# Altium project PCB_testMiltibard.PrjPCB
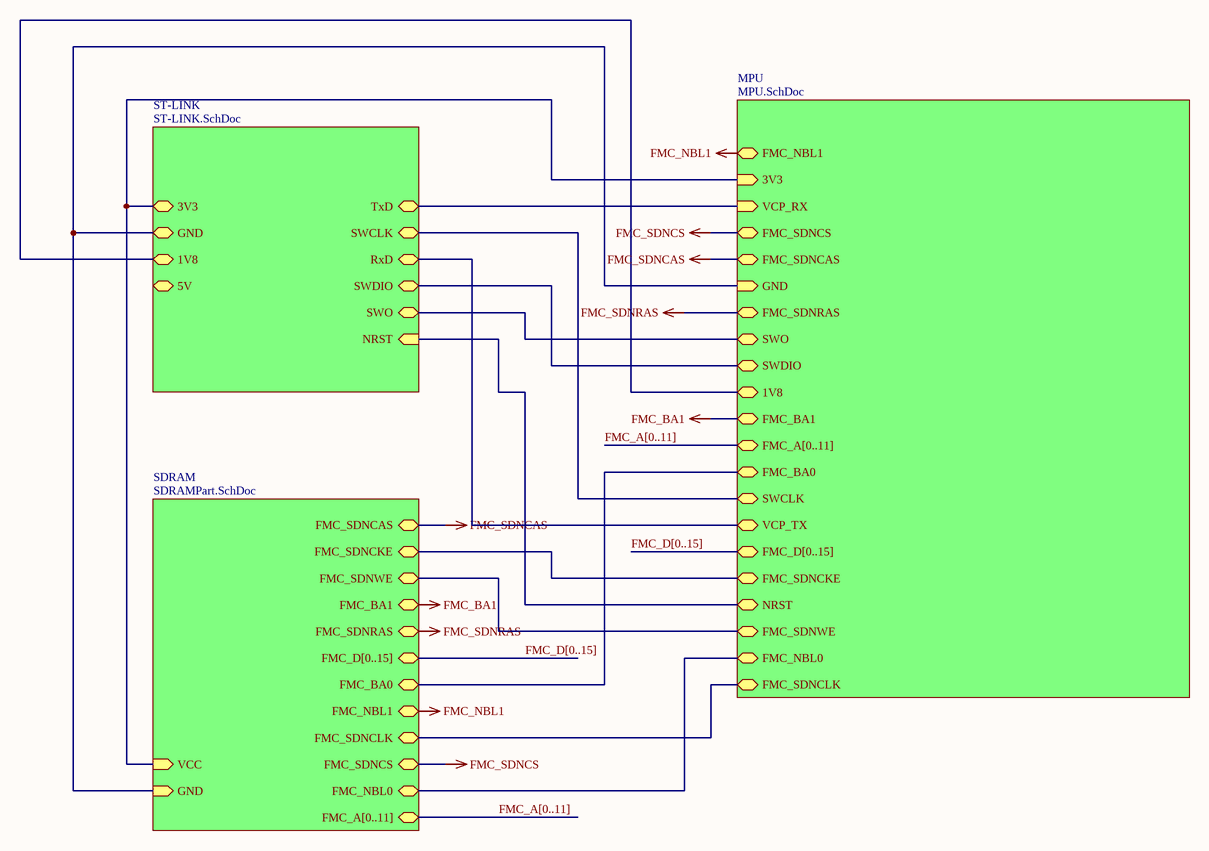
[diagram p0: Main.SchDoc]
4 sheets, 120 parts. Net scope: hierarchical (ports join the sheet entries above them; power ports are global).
Board file: PCB1.PcbDoc
Sheets:
  Main.SchDoc
    MPU = MPU.SchDoc
    ST-LINK = ST-LINK.SchDoc
    SDRAM = SDRAMPart.SchDoc

## Sheet Main.SchDoc
size 420 x 297 mm; Address1: Address1; Address2: Address2; Address3: Address3; Address4: Address4; SheetNumber: 1; Scale: 1:1; Разраб.: Иванов; Обозначение документа: АБВГ.123456.001 Э3; Пров.: Петров; Утв.: Сидоров; Наименование организации: ОАО "Концерн "МПО-Гидроприбор"; Перв. применение: АБВГ.123456.000; Наименование изделия 1: Плата; Наименование изделия 2: Схема электрическая; Наименование изделия 3: принципиальная; Нач. отд.: Нач. отд.; Фамилия нач. отд.: Сидоров

### Sub-sheets
MPU = MPU.SchDoc: FMC_NBL1 (bidir), 3V3 (in), VCP_RX (in), FMC_SDNCS (bidir), FMC_SDNCAS (bidir), GND (in), FMC_SDNRAS (bidir), SWO, SWDIO, 1V8, FMC_BA1 (bidir), FMC_A[0..11] (bidir), FMC_BA0 (bidir), SWCLK, VCP_TX, FMC_D[0..15] (bidir), FMC_SDNCKE (bidir), NRST, FMC_SDNWE (bidir), FMC_NBL0 (bidir), FMC_SDNCLK (bidir)
SDRAM = SDRAMPart.SchDoc: FMC_SDNCAS (bidir), FMC_SDNCKE (bidir), FMC_SDNWE (bidir), FMC_BA1 (bidir), FMC_SDNRAS (bidir), FMC_D[0..15] (bidir), FMC_BA0 (bidir), FMC_NBL1 (bidir), FMC_SDNCLK (bidir), FMC_SDNCS (bidir), FMC_NBL0 (bidir), FMC_A[0..11] (bidir), VCC (in), GND (in)
ST-LINK = ST-LINK.SchDoc: TxD (bidir), SWCLK (bidir), RxD (bidir), SWDIO (bidir), SWO (bidir), NRST (in), 3V3 (bidir), GND (bidir), 1V8 (bidir), 5V (bidir)

### Nets
1V8: sheet MPU/1V8, sheet ST-LINK/1V8
3V3: sheet MPU/3V3, sheet ST-LINK/3V3, sheet SDRAM/VCC
FMC_BA1: sheet MPU/FMC_BA1, sheet SDRAM/FMC_BA1
FMC_NBL1: sheet MPU/FMC_NBL1, sheet SDRAM/FMC_NBL1
FMC_SDNCAS: sheet MPU/FMC_SDNCAS, sheet SDRAM/FMC_SDNCAS
FMC_SDNCS: sheet MPU/FMC_SDNCS, sheet SDRAM/FMC_SDNCS
FMC_SDNRAS: sheet MPU/FMC_SDNRAS, sheet SDRAM/FMC_SDNRAS
GND: sheet MPU/GND, sheet ST-LINK/GND, sheet SDRAM/GND
NRST: sheet MPU/NRST, sheet ST-LINK/NRST
SWCLK: sheet MPU/SWCLK, sheet ST-LINK/SWCLK
SWDIO: sheet MPU/SWDIO, sheet ST-LINK/SWDIO
SWO: sheet MPU/SWO, sheet ST-LINK/SWO
VCP_RX: sheet MPU/VCP_RX, sheet ST-LINK/TxD
VCP_TX: sheet MPU/VCP_TX, sheet ST-LINK/RxD
FMC_BA0: sheet MPU/FMC_BA0, sheet SDRAM/FMC_BA0
FMC_NBL0: sheet MPU/FMC_NBL0, sheet SDRAM/FMC_NBL0
FMC_SDNCKE: sheet MPU/FMC_SDNCKE, sheet SDRAM/FMC_SDNCKE
FMC_SDNCLK: sheet MPU/FMC_SDNCLK, sheet SDRAM/FMC_SDNCLK
FMC_SDNWE: sheet MPU/FMC_SDNWE, sheet SDRAM/FMC_SDNWE

### Buses and harness runs
bus FMC_A[0..11] = sheet MPU/FMC_A[0..11]
bus FMC_A[0..11] = sheet SDRAM/FMC_A[0..11]
bus FMC_D[0..15] = sheet MPU/FMC_D[0..15]
bus FMC_D[0..15] = sheet SDRAM/FMC_D[0..15]

### Notes on the sheet
- Перв. примен.
- Справ. №
- Подп. и дата
- Инв. № дубл.
- Взам. инв. №
- Разраб.
- Изм.
- Лист
- № докум.
- Подп.
- Дата
- Лит.
- Масса
- Масштаб
- Пров.
- Т.контр.
- Листов
- Инв. № подл.
- Утв.
- Н.контр.
- Копировал
- Формат А3

## Sheet MPU.SchDoc
size 420 x 297 mm; Address1: Address1; Address2: Address2; Address3: Address3; Address4: Address4; SheetNumber: 1; Scale: 1:1; Разраб.: Иванов; Обозначение документа: АБВГ.123456.001 Э3; Пров.: Петров; Утв.: Сидоров; Наименование организации: ОАО "Концерн "МПО-Гидроприбор"; Перв. применение: АБВГ.123456.000; Наименование изделия 1: Плата; Наименование изделия 2: Схема электрическая; Наименование изделия 3: принципиальная; Нач. отд.: Нач. отд.; Фамилия нач. отд.: Сидоров
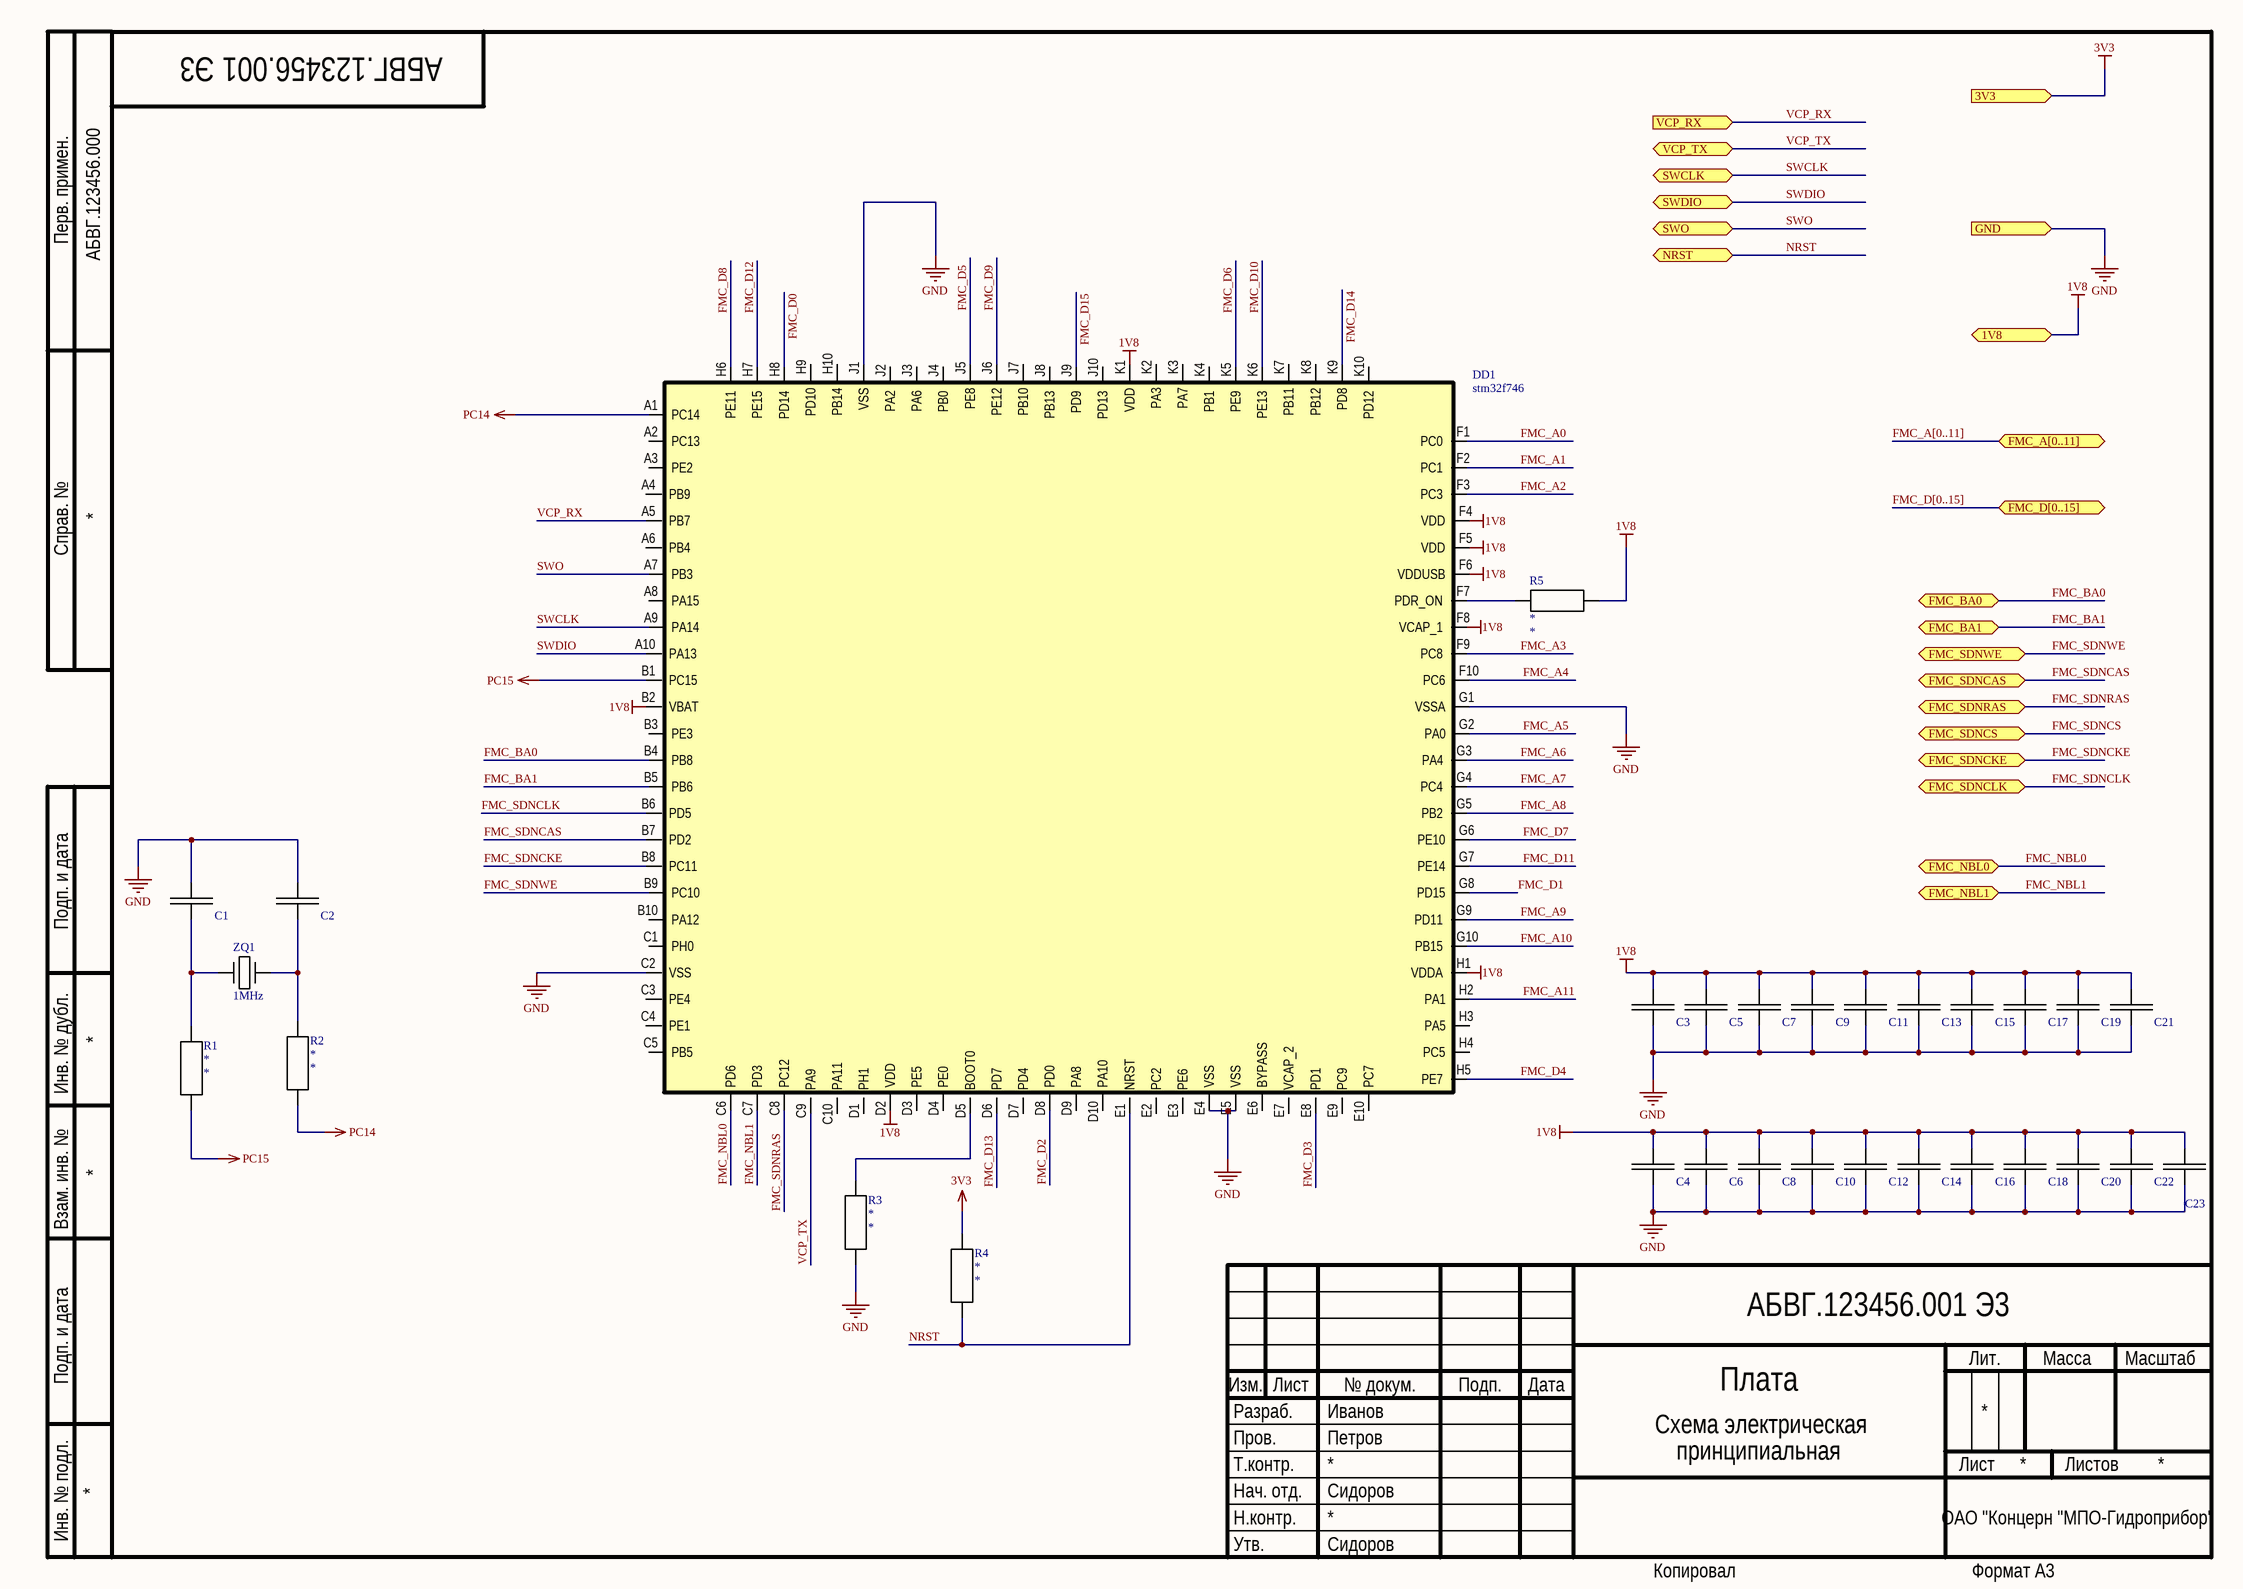
[diagram p1: MPU.SchDoc]

### Parts
C1  *  [CAP0402]  (value not drawn)
C2  *  [CAP0402]  (value not drawn)
C3  *  [CAP0402]  (value not drawn)
C4  *  [CAP0402]  (value not drawn)
C5  *  [CAP0402]  (value not drawn)
C6  *  [CAP0402]  (value not drawn)
C7  *  [CAP0402]  (value not drawn)
C8  *  [CAP0402]  (value not drawn)
C9  *  [CAP0402]  (value not drawn)
C10  *  [CAP0402]  (value not drawn)
C11  *  [CAP0402]  (value not drawn)
C12  *  [CAP0402]  (value not drawn)
C13  *  [CAP0402]  (value not drawn)
C14  *  [CAP0402]  (value not drawn)
C15  *  [CAP0402]  (value not drawn)
C16  *  [CAP0402]  (value not drawn)
C17  *  [CAP0402]  (value not drawn)
C18  *  [CAP0402]  (value not drawn)
C19  *  [CAP0402]  (value not drawn)
C20  *  [CAP0402]  (value not drawn)
C21  *  [CAP0402]  (value not drawn)
C22  *  [CAP0402]  (value not drawn)
C23  *  [CAP0402]  (value not drawn)
DD1  stm32f746  [BGA100P9X9-81A]
R1  *  [0402]
R2  *  [0402]
R3  *  [0402]
R4  *  [0402]
R5  *  [0402]
ZQ1  1MHz  [KX-7]

### Ports
1V8, 3V3 (in), FMC_A[0..11] (bidir), FMC_BA0 (bidir), FMC_BA1 (bidir), FMC_D[0..15] (bidir), FMC_NBL0 (bidir), FMC_NBL1 (bidir), FMC_SDNCAS (bidir), FMC_SDNCKE (bidir), FMC_SDNCLK (bidir), FMC_SDNCS (bidir), FMC_SDNRAS (bidir), FMC_SDNWE (bidir), GND (in), NRST, SWCLK, SWDIO, SWO, VCP_RX (in), VCP_TX

### Nets
1V8: C3.1 C4.1 C5.1 C6.1 C7.1 C8.1 C9.1 C10.1 C11.1 C12.1 C13.1 C14.1 C15.1 C16.1 C17.1 C18.1 C19.1 C20.1 C21.1 C22.1 C23.1 DD1.B2(VBAT) DD1.D2(VDD) DD1.F4(VDD) DD1.F5(VDD) DD1.F6(VDDUSB) DD1.F8(VCAP_1) DD1.H1(VDDA) DD1.K1(VDD) R5.1 ; port 1V8
3V3: R4.2 ; port 3V3
FMC_BA1: DD1.B5(PB6) ; port FMC_BA1
FMC_NBL1: DD1.C7(PD3) ; port FMC_NBL1
FMC_SDNCAS: DD1.B7(PD2) ; port FMC_SDNCAS
FMC_SDNRAS: DD1.C8(PC12) ; port FMC_SDNRAS
GND: C1.1 C2.1 C3.2 C4.2 C5.2 C6.2 C7.2 C8.2 C9.2 C10.2 C11.2 C12.2 C13.2 C14.2 C15.2 C16.2 C17.2 C18.2 C19.2 C20.2 C21.2 C22.2 C23.2 DD1.C2(VSS) DD1.E4(VSS) DD1.E5(VSS) DD1.G1(VSSA) DD1.J1(VSS) R3.1 ; port GND
NRST: DD1.E1(NRST) R4.1 ; port NRST
PC14: DD1.A1(PC14) R2.1
PC15: DD1.B1(PC15) R1.1
SWCLK: DD1.A9(PA14) ; port SWCLK
SWDIO: DD1.A10(PA13) ; port SWDIO
SWO: DD1.A7(PB3) ; port SWO
VCP_RX: DD1.A5(PB7) ; port VCP_RX
VCP_TX: DD1.C9(PA9) ; port VCP_TX
FMC_A0: DD1.F1(PC0)
FMC_A1: DD1.F2(PC1)
FMC_A2: DD1.F3(PC3)
FMC_A3: DD1.F9(PC8)
FMC_A4: DD1.F10(PC6)
FMC_A5: DD1.G2(PA0)
FMC_A6: DD1.G3(PA4)
FMC_A7: DD1.G4(PC4)
FMC_A8: DD1.G5(PB2)
FMC_A9: DD1.G9(PD11)
FMC_A10: DD1.G10(PB15)
FMC_A11: DD1.H2(PA1)
FMC_BA0: DD1.B4(PB8) ; port FMC_BA0
FMC_D0: DD1.H8(PD14)
FMC_D1: DD1.G8(PD15)
FMC_D2: DD1.D8(PD0)
FMC_D3: DD1.E8(PD1)
FMC_D4: DD1.H5(PE7)
FMC_D5: DD1.J5(PE8)
FMC_D6: DD1.K5(PE9)
FMC_D7: DD1.G6(PE10)
FMC_D8: DD1.H6(PE11)
FMC_D9: DD1.J6(PE12)
FMC_D10: DD1.K6(PE13)
FMC_D11: DD1.G7(PE14)
FMC_D12: DD1.H7(PE15)
FMC_D13: DD1.D6(PD7)
FMC_D14: DD1.K9(PD8)
FMC_D15: DD1.J9(PD9)
FMC_NBL0: DD1.C6(PD6) ; port FMC_NBL0
FMC_SDNCKE: DD1.B8(PC11) ; port FMC_SDNCKE
FMC_SDNCLK: DD1.B6(PD5) ; port FMC_SDNCLK
FMC_SDNWE: DD1.B9(PC10) ; port FMC_SDNWE
NetC1_2: C1.2 R1.2 ZQ1.1
NetC2_2: C2.2 R2.2 ZQ1.3
NetDD1_D5: DD1.D5(BOOT0) R3.2
NetDD1_F7: DD1.F7(PDR_ON) R5.2

Not connected (* = marked no-connect by the designer): DD1 A2(PC13) A3(PE2) A4(PB9) A6(PB4) A8(PA15) B3(PE3) B10(PA12) C1(PH0) C3(PE4) C4(PE1) C5(PB5) C10(PA11) D1(PH1) D3(PE5) D4(PE0) D7(PD4) D9(PA8) D10(PA10) E2(PC2) E3(PE6) E6(BYPASS) E7(VCAP_2) E9(PC9) E10(PC7) H3(PA5) H4(PC5) H9(PD10) H10(PB14) J2(PA2) J3(PA6) J4(PB0) J7(PB10) J8(PB13) J10(PD13) K2(PA3) K3(PA7) K4(PB1) K7(PB11) K8(PB12) K10(PD12)

### Buses and harness runs
bus FMC_A[0..11] = port FMC_A[0..11]
bus FMC_D[0..15] = port FMC_D[0..15]

### Notes on the sheet
- Перв. примен.
- Справ. №
- Подп. и дата
- Инв. № дубл.
- Взам. инв. №
- Разраб.
- Изм.
- Лист
- № докум.
- Подп.
- Дата
- Лит.
- Масса
- Масштаб
- Пров.
- Т.контр.
- Листов
- Инв. № подл.
- Утв.
- Н.контр.
- Копировал
- Формат А3

### Library data of the parts
C1-C23 = Capasitor: Value: *; Voltage: *; Part Number: *; Quantity: *; Package: *; Price: *; Manufacturer: *; ShoppingPlace: *
DD1 = stm32f746: Manufacturer: STM; Part Number: stm32f746; Package: LQFP48; Quantity: 1
R1-R5 = Resistor: Manufacturer: *; Quntity: *; Price: *; Part Number: *; Package: *; Value: *; Power: *
ZQ1 = Rzanator: Part Number: HC-51; Manufacturer: CHina; Value: 1MHz; Package: HC-51; Quantity: 1; Price: 13; ShoppingPlace: https://ru.aliexpress.com/item/1-MHz-Quartz-Crystal-Resonator-HC-51-U-1-000-MHz-1000-KHz/32542776281.html?ws_ab_test=searchweb0_0,searchweb201602_2_10152_10151_10065_10344_10068_10342_10343_10340_10341_10697_10696_10084_5722520_10083_10618_10307_10059_5722620_5722920_10534_308_5722720_5722820_100031_10103_441_10624_10623_10622_10621_10620,searchweb201603_68,ppcSwitch_5&algo_expid=89d4295e-121a-47e9-b7f5-26405723b7a9-0&algo_pvid=89d4295e-121a-47e9-b7f5-26405723b7a9&transAbTest=ae803_2&priceBeautifyAB=0

## Sheet ST-LINK.SchDoc
size 594 x 420 mm; Address1: Address1; Address2: Address2; Address3: Address3; Address4: Address4; SheetNumber: 1; Scale: 1:1; Разраб.: Иванов; Обозначение документа: АБВГ.123456.001 Э3; Пров.: Петров; Утв.: Сидоров; Наименование организации: ОАО "Концерн "МПО-Гидроприбор"; Перв. применение: АБВГ.123456.000; Наименование изделия 1: Плата; Наименование изделия 2: Схема электрическая; Наименование изделия 3: принципиальная; Нач. отд.: Нач. отд.; Фамилия нач. отд.: Сидоров
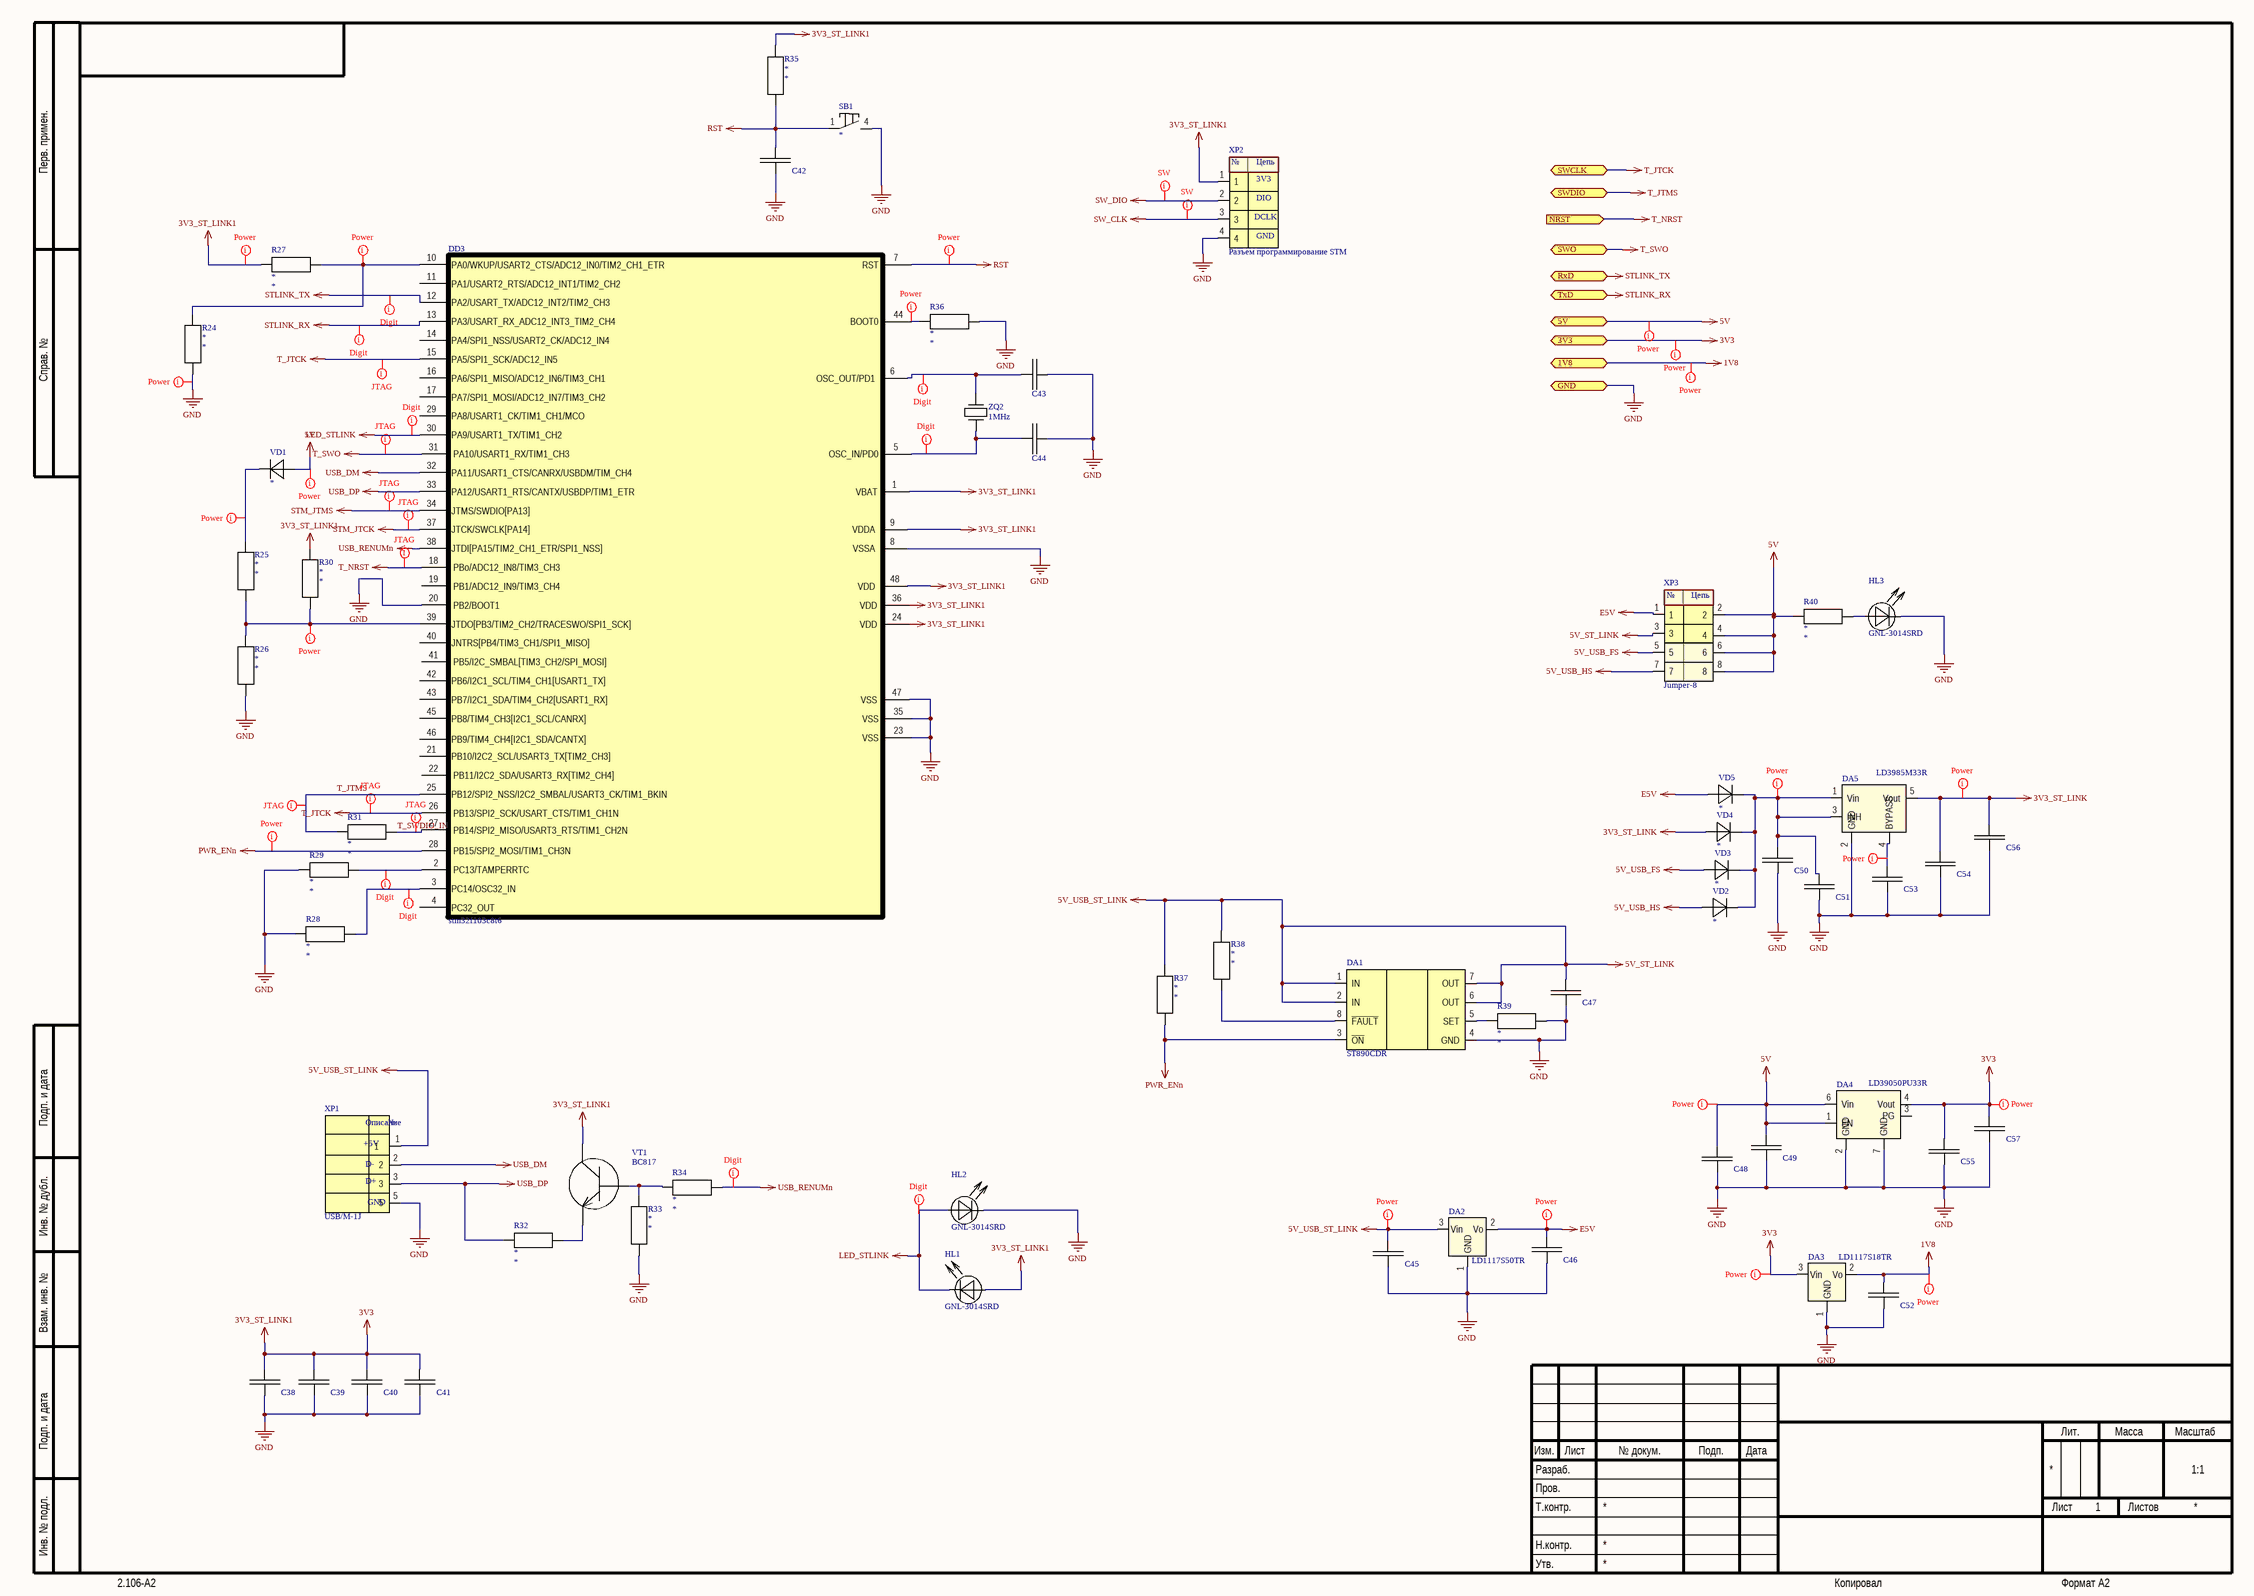
[diagram p2: ST-LINK.SchDoc]

### Parts
C38  *  [CAP0402]  (value not drawn)
C39  *  [CAP0402]  (value not drawn)
C40  *  [CAP0402]  (value not drawn)
C41  *  [CAP0402]  (value not drawn)
C42  *  [CAP0402]  (value not drawn)
C43  *  [CAP0402]  (value not drawn)
C44  *  [CAP0402]  (value not drawn)
C45  *  [CAP0402]  (value not drawn)
C46  *  [CAP0402]  (value not drawn)
C47  *  [CAP0402]  (value not drawn)
C48  *  [CAP0402]  (value not drawn)
C49  *  [CAP0402]  (value not drawn)
C50  *  [CAP0402]  (value not drawn)
C51  *  [CAP0402]  (value not drawn)
C52  *  [CAP0402]  (value not drawn)
C53  *  [CAP0402]  (value not drawn)
C54  *  [CAP0402]  (value not drawn)
C55  *  [CAP0402]  (value not drawn)
C56  *  [CAP0402]  (value not drawn)
C57  *  [CAP0402]  (value not drawn)
DA1  ST890CDR  [SO-8]
DA2  LD1117S50TR  [SOD-223]
DA3  LD1117S18TR  [SOD-223]
DA4  LD39050PU33R  [DFN-6(3x3)]
DA5  LD3985M33R  [SOT23-5]
DD3  stm32f103c8t6  [LQFP48]
HL1  GNL-3014SRD  [LED1206]
HL2  GNL-3014SRD  [LED1206]
HL3  GNL-3014SRD  [LED1206]
R24  *  [0402]
R25  *  [0402]
R26  *  [0402]
R27  *  [0402]
R28  *  [0402]
R29  *  [0402]
R30  *  [0402]
R31  *  [0402]
R32  *  [0402]
R33  *  [0402]
R34  *  [0402]
R35  *  [0402]
R36  *  [0402]
R37  *  [0402]
R38  *  [0402]
R39  *  [0402]
R40  *  [0402]
SB1  *  [KLS2]
VD1  *  [melf]
VD2  *  [MINIMELF]
VD3  *  [MINIMELF]
VD4  *  [MINIMELF]
VD5  *  [MINIMELF]
VT1  BC817  [SOT23-3]
XP1  USB/M-1J  [USB/M-1J]
XP2  Разъем программирование STM  [Connector_STKLink]
XP3  Jumper-8  [PLS-4-2]
ZQ2  1MHz  [HC-51U]

### Ports
1V8 (bidir), 3V3 (bidir), 5V (bidir), GND (bidir), NRST (in), RxD (bidir), SWCLK (bidir), SWDIO (bidir), SWO (bidir), TxD (bidir)

### Nets
1V8: C52.1 DA3.2(Vo) ; port 1V8
3V3: C38.1 C39.1 C40.1 C41.1 C55.1 C57.1 DA3.3(Vin) DA4.4(Vout) DD3.1(VBAT) DD3.9(VDDA) DD3.24(VDD) DD3.36(VDD) DD3.48(VDD) HL1.1 R27.1 R30.2 R35.2 VT1.3 XP2.1 ; port 3V3  [also labelled 3V3_ST_LINK1]
3V3_ST_LINK: C54.1 C56.1 DA5.5(Vout) VD4.1
5V: C48.1 C49.1 DA4.1(EN) DA4.6(Vin) R40.2 VD1.1 XP3.2 XP3.4 XP3.6 XP3.8 ; port 5V
5V_ST_LINK: C45.1 C47.1 DA1.1(IN) DA1.2(IN) DA1.6(OUT) DA1.7(OUT) DA2.3(Vin) R37.2 R38.2 XP1.1 XP3.3  [also labelled 5V_USB_ST_LINK]
5V_USB_FS: VD3.1 XP3.5
5V_USB_HS: VD2.1 XP3.7
E5V: C46.1 DA2.2(Vo) VD5.1 XP3.1
GND: C38.2 C39.2 C40.2 C41.2 C42.2 C43.2 C44.2 C45.2 C46.2 C47.2 C48.2 C49.2 C50.2 C51.2 C52.2 C53.2 C54.2 C55.2 C56.2 C57.2 DA1.4(GND) DA2.1(GND) DA3.1(GND) DA4.2(GND) DA4.7(GND) DA5.2(GND) DD3.8(VSSA) DD3.20(PB2/BOOT1) DD3.23(VSS) DD3.35(VSS) DD3.47(VSS) HL2.2 HL3.2 R24.1 R26.1 R28.1 R29.1 R33.1 R36.1 R39.1 SB1.4 XP1.5 XP2.4 ; port GND
LED_STLINK: DD3.30(PA9/USART1_TX/TIM1_CH2) HL1.2 HL2.1
PWR_ENn: DA1.3(~{ON}) DD3.28(PB15/SPI2_MOSI/TIM1_CH3N) R37.1
RST: C42.1 DD3.7(RST) R35.1 SB1.1
STLINK_RX: DD3.13(PA3/USART_RX_ADC12_INT3_TIM2_CH4) ; port TxD  [project net VCP_RX]
STLINK_TX: DD3.12(PA2/USART_TX/ADC12_INT2/TIM2_CH3) ; port RxD  [project net VCP_TX]
STM_JTCK: DD3.37(JTCK/SWCLK[PA14])
STM_JTMS: DD3.34(JTMS/SWDIO[PA13])
SW_CLK: XP2.3
SW_DIO: XP2.2
T_JTCK: DD3.15(PA5/SPI1_SCK/ADC12_IN5) DD3.26(PB13/SPI2_SCK/USART_CTS/TIM1_CH1N) ; port SWCLK  [project net SWCLK]
T_JTMS: DD3.25(PB12/SPI2_NSS/I2C2_SMBAL/USART3_CK/TIM1_BKIN) R31.1 ; port SWDIO  [project net SWDIO]
T_NRST: DD3.18(PBo/ADC12_IN8/TIM3_CH3) ; port NRST  [project net NRST]
T_SWO: DD3.31(PA10/USART1_RX/TIM1_CH3) ; port SWO  [project net SWO]
USB_DM: DD3.32(PA11/USART1_CTS/CANRX/USBDM/TIM_CH4) XP1.2
USB_DP: DD3.33(PA12/USART1_RTS/CANTX/USBDP/TIM1_ETR) R32.1 XP1.3
USB_RENUMn: DD3.38(JTDI[PA15/TIM2_CH1_ETR/SPI1_NSS]) R34.2
T_SWDIO_IN: DD3.27(PB14/SPI2_MISO/USART3_RTS/TIM1_CH2N) R31.2
NetC43_1: C43.1 DD3.6(OSC_OUT/PD1) ZQ2.3
NetC44_1: C44.1 DD3.5(OSC_IN/PD0) ZQ2.1
NetC50_1: C50.1 C51.1 DA5.1(Vin) DA5.3(INH) VD2.2 VD3.2 VD4.2 VD5.2
NetC53_1: C53.1 DA5.4(BYPASS)
NetDA1_5: DA1.5(SET) R39.2
NetDA1_8: DA1.8(~{FAULT}) R38.1
NetDD3_2: DD3.2(PC13/TAMPERRTC) R29.2
NetDD3_3: DD3.3(PC14/OSC32_IN) R28.2
NetDD3_10: DD3.10(PA0/WKUP/USART2_CTS/ADC12_IN0/TIM2_CH1_ETR) R24.2 R27.2
NetDD3_39: DD3.39(JTDO[PB3/TIM2_CH2/TRACESWO/SPI1_SCK]) R25.1 R26.2 R30.1
NetDD3_44: DD3.44(BOOT0) R36.2
NetHL3_1: HL3.1 R40.1
NetR25_2: R25.2 VD1.2
NetR32_2: R32.2 VT1.2
NetR33_2: R33.2 R34.1 VT1.1

Not connected (* = marked no-connect by the designer): DA4 3(PG); DD3 4(PC32_OUT) 11(PA1/USART2_RTS/ADC12_INT1/TIM2_CH2) 14(PA4/SPI1_NSS/USART2_CK/ADC12_IN4) 16(PA6/SPI1_MISO/ADC12_IN6/TIM3_CH1) 17(PA7/SPI1_MOSI/ADC12_IN7/TIM3_CH2) 19(PB1/ADC12_IN9/TIM3_CH4) 21(PB10/I2C2_SCL/USART3_TX[TIM2_CH3]) 22(PB11/I2C2_SDA/USART3_RX[TIM2_CH4]) 29(PA8/USART1_CK/TIM1_CH1/MCO) 40(JNTRS[PB4/TIM3_CH1/SPI1_MISO]) 41(PB5/I2C_SMBAL[TIM3_CH2/SPI_MOSI]) 42(PB6/I2C1_SCL/TIM4_CH1[USART1_TX]) 43(PB7/I2C1_SDA/TIM4_CH2[USART1_RX]) 45(PB8/TIM4_CH3[I2C1_SCL/CANRX]) 46(PB9/TIM4_CH4[I2C1_SDA/CANTX])

### Layout directives
net class Power: 1V8, 3V3, 3V3_ST_LINK, 5V, 5V_ST_LINK, E5V, GND, NetC50_1, NetC53_1, NetDD3_10, NetDD3_39, NetDD3_44, NetR25_2, PWR_ENn, RST
net class DIGIT: LED_STLINK, NetC43_1, NetC44_1, NetDD3_2, NetDD3_3, USB_RENUMn, VCP_RX, VCP_TX
net class JTAG: NRST, STM_JTCK, STM_JTMS, SWCLK, SWDIO, SWO, T_SWDIO_IN
net class SerialWire: SW_CLK, SW_DIO

### Notes on the sheet
- Перв. примен.
- Справ. №
- Подп. и дата
- Инв. № дубл.
- Взам. инв. №
- Разраб.
- Изм.
- Лист
- № докум.
- Подп.
- Дата
- Лит.
- Масса
- Масштаб
- Пров.
- Т.контр.
- Листов
- Инв. № подл.
- Утв.
- Н.контр.
- 2.106-A2
- Копировал
- Формат А2
- (in symbol Connector_STKLink) №; Цепь; 3V3; DIO; DCLK; GND
- (in symbol Jumper-8) №; Цепь
- (in symbol USB-M-1J) Описание; №; +5V; D-; D+; GND

### Library data of the parts
C38-C57 = Capasitor: Value: *; Voltage: *; Part Number: *; Quantity: *; Package: *; Price: *; Manufacturer: *; ShoppingPlace: *
DA1 = ST890CDR: Manufacturer: Texas Instruments; Value: 3V; Part Number: ST890CDR; Quantity: 1; Package: SOT-23-6; Price: 1.58; ShoppingPlace: https://www.digikey.com/product-detail/en/texas-instruments/TPS78230DDCR/296-24372-2-ND/2051745
DA2 = LD1117S50TR: Manufacturer: Texas Instruments; Value: 3V; Part Number: LD1117S50TR; Quantity: 1; Package: SOT-23-6; Price: 1.58
DA3 = LD1117S18TR: Manufacturer: Texas Instruments; Value: 3V; Part Number: LD1117S18TR; Quantity: 1; Package: SOT-23-6; Price: 1.58
DA4 = LD39050PU33R: Manufacturer: Texas Instruments; Value: 3V; Part Number: LD39050PU33R; Quantity: 1; Package: SOT-23-6; Price: 1.58
DA5 = LD3985M33R: Manufacturer: Texas Instruments; Value: 3V; Part Number: LD3985M33R; Quantity: 1; Package: SOT-23-6; Price: 1.58; ShoppingPlace: https://www.digikey.com/product-detail/en/texas-instruments/TPS78230DDCR/296-24372-2-ND/2051745
DD3 = stm32f103c8t6: Manufacturer: STM; Part Number: stm32f103c8t6; Package: LQFP48; Quantity: 1
HL1-HL3 = LED: Manufacturer: G-NOR; Value: RED; Part Number: GNL-3014SRD; Price: 0.04; Package: GNL; Quantity: 6; Shopping Place: http://belchip.by/product/?selected_product=00813
R24-R40 = Resistor: Manufacturer: *; Quntity: *; Price: *; Part Number: *; Package: *; Value: *; Power: *
SB1 = Button: Part Number: *; Price: *; Value: *; ShoppingPlace: *; Quantity: *; Package: *; Manufacturer: *
VD1-VD5 = Basic_Diode: Part Number: *; Package: *; Value: *; Price: *; ShoppingPlace: *; Documantation: *
VT1 = BC817: Manufacturer: NXP Semiconductors; Value: 45V,500mA; Part Number: BC817; Price: BC817; Quantity: 2; Documantion: https://www.diodes.com/assets/Datasheets/ds11107.pdf
XP1 = USB-M-1J: Manufacturer: ESB; ShoppingPlace: http://belchip.by/product/?selected_product=07369; Price: 2; Value: *; Package: ESB 22 SERIES; Part Number: USB/M-1J; Quantity: 1
XP2 = Connector_STKLink: Part Number: *; Value: *; Manufacturer: *; Price: *; Quantity: *; shoppingPlace: *
ZQ2 = Rzanator: Part Number: HC-51; Manufacturer: CHina; Value: 1MHz; Package: HC-51; Quantity: 1; Price: 13; ShoppingPlace: https://ru.aliexpress.com/item/1-MHz-Quartz-Crystal-Resonator-HC-51-U-1-000-MHz-1000-KHz/32542776281.html?ws_ab_test=searchweb0_0,searchweb201602_2_10152_10151_10065_10344_10068_10342_10343_10340_10341_10697_10696_10084_5722520_10083_10618_10307_10059_5722620_5722920_10534_308_5722720_5722820_100031_10103_441_10624_10623_10622_10621_10620,searchweb201603_68,ppcSwitch_5&algo_expid=89d4295e-121a-47e9-b7f5-26405723b7a9-0&algo_pvid=89d4295e-121a-47e9-b7f5-26405723b7a9&transAbTest=ae803_2&priceBeautifyAB=0
XP3 = Jumper-8: Package: *; Part Number: *; Value: *; Quantity: *; Price: *

## Sheet SDRAMPart.SchDoc
size 420 x 297 mm; Address1: Address1; Address2: Address2; Address3: Address3; Address4: Address4; SheetNumber: 1; Scale: 1:1; Разраб.: Иванов; Обозначение документа: АБВГ.123456.001 Э3; Пров.: Петров; Утв.: Сидоров; Наименование организации: ОАО "Концерн "МПО-Гидроприбор"; Перв. применение: АБВГ.123456.000; Наименование изделия 1: Плата; Наименование изделия 2: Схема электрическая; Наименование изделия 3: принципиальная; Нач. отд.: Нач. отд.; Фамилия нач. отд.: Сидоров
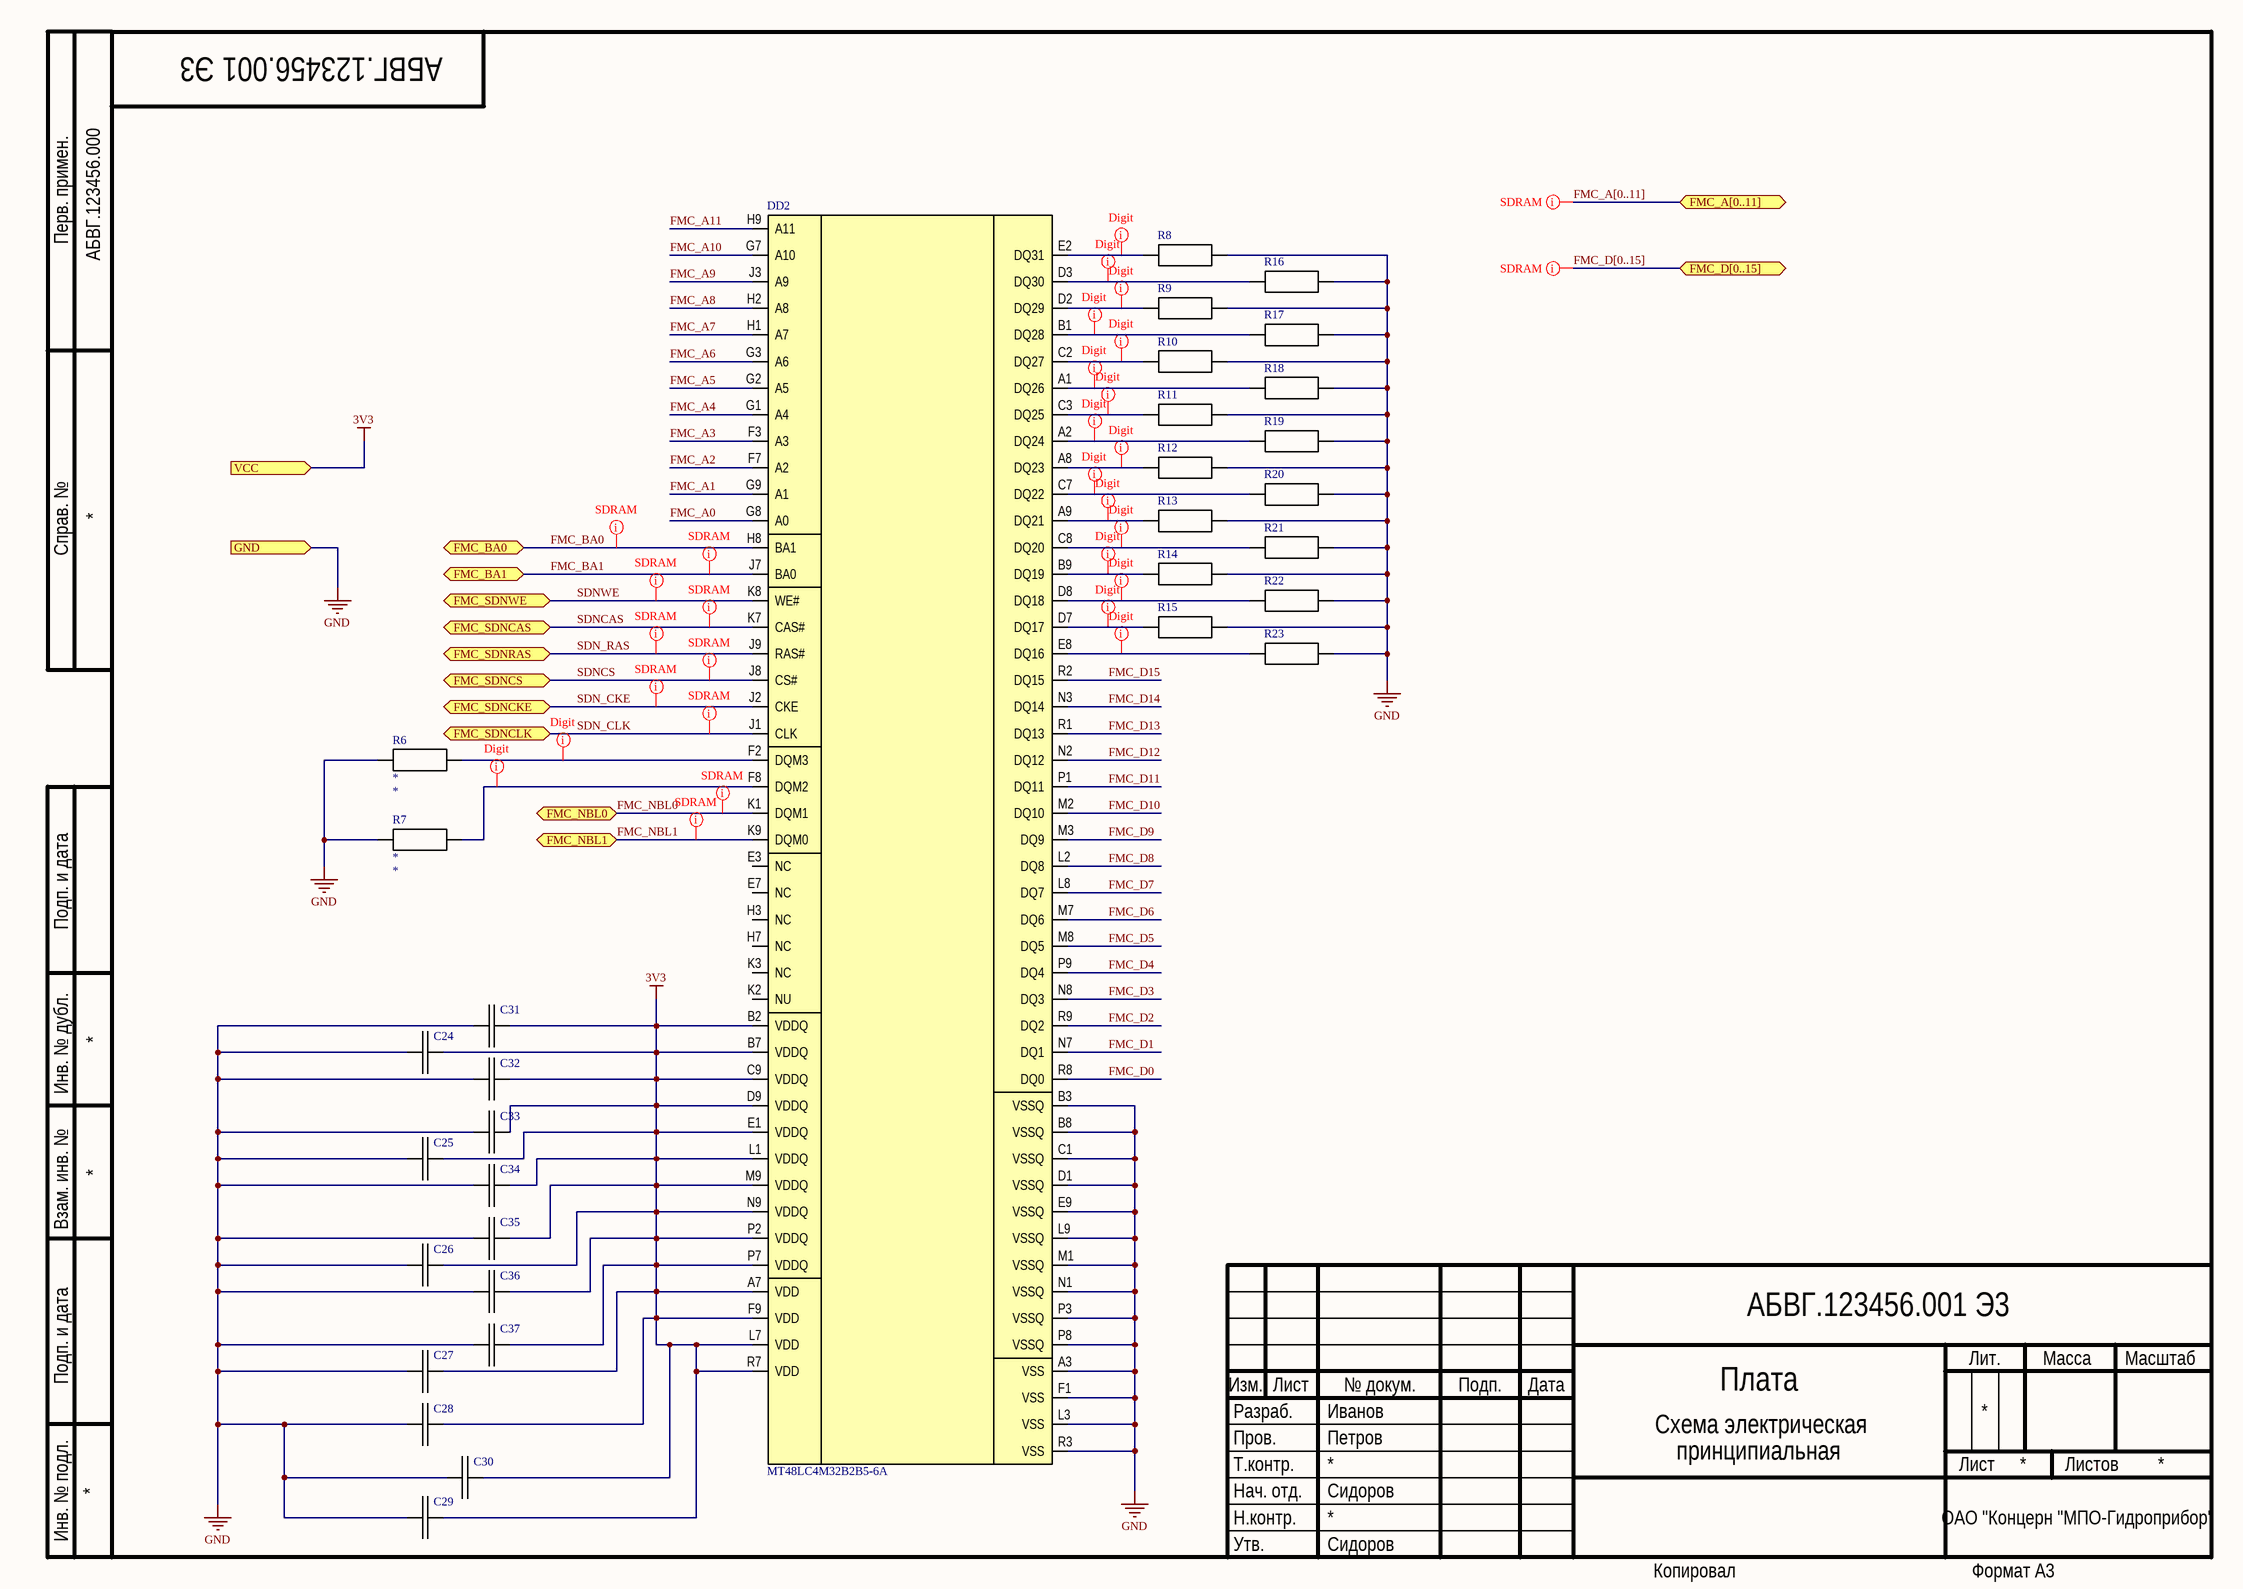
[diagram p3: SDRAMPart.SchDoc]

### Parts
C24  *  [CAP1206]  (value not drawn)
C25  *  [CAP1206]  (value not drawn)
C26  *  [CAP1206]  (value not drawn)
C27  *  [CAP1206]  (value not drawn)
C28  *  [CAP1206]  (value not drawn)
C29  *  [CAP1206]  (value not drawn)
C30  *  [CAP1206]  (value not drawn)
C31  *  [CAP1206]  (value not drawn)
C32  *  [CAP1206]  (value not drawn)
C33  *  [CAP1206]  (value not drawn)
C34  *  [CAP1206]  (value not drawn)
C35  *  [CAP1206]  (value not drawn)
C36  *  [CAP1206]  (value not drawn)
C37  *  [CAP1206]  (value not drawn)
DD2  MT48LC4M32B2B5-6A  [VFBGA90]
R6  *  [1206]
R7  *  [1206]
R8  *  [0402]  (value not drawn)
R9  *  [0402]  (value not drawn)
R10  *  [0402]  (value not drawn)
R11  *  [0402]  (value not drawn)
R12  *  [0402]  (value not drawn)
R13  *  [0402]  (value not drawn)
R14  *  [0402]  (value not drawn)
R15  *  [0402]  (value not drawn)
R16  *  [0402]  (value not drawn)
R17  *  [0402]  (value not drawn)
R18  *  [0402]  (value not drawn)
R19  *  [0402]  (value not drawn)
R20  *  [0402]  (value not drawn)
R21  *  [0402]  (value not drawn)
R22  *  [0402]  (value not drawn)
R23  *  [0402]  (value not drawn)

### Ports
FMC_A[0..11] (bidir), FMC_BA0 (bidir), FMC_BA1 (bidir), FMC_D[0..15] (bidir), FMC_NBL0 (bidir), FMC_NBL1 (bidir), FMC_SDNCAS (bidir), FMC_SDNCKE (bidir), FMC_SDNCLK (bidir), FMC_SDNCS (bidir), FMC_SDNRAS (bidir), FMC_SDNWE (bidir), GND (in), VCC (in)

### Nets
3V3: C24.2 C25.2 C26.2 C27.2 C28.2 C29.2 C30.2 C31.2 C32.2 C33.2 C34.2 C35.2 C36.2 C37.2 DD2.A7(VDD) DD2.B2(VDDQ) DD2.B7(VDDQ) DD2.C9(VDDQ) DD2.D9(VDDQ) DD2.E1(VDDQ) DD2.F9(VDD) DD2.L1(VDDQ) DD2.L7(VDD) DD2.M9(VDDQ) DD2.N9(VDDQ) DD2.P2(VDDQ) DD2.P7(VDDQ) DD2.R7(VDD) ; port VCC
FMC_BA1: DD2.J7(BA0) ; port FMC_BA1
FMC_NBL1: DD2.K9(DQM0) ; port FMC_NBL1
GND: C24.1 C25.1 C26.1 C27.1 C28.1 C29.1 C30.1 C31.1 C32.1 C33.1 C34.1 C35.1 C36.1 C37.1 DD2.A3(VSS) DD2.B3(VSSQ) DD2.B8(VSSQ) DD2.C1(VSSQ) DD2.D1(VSSQ) DD2.E9(VSSQ) DD2.F1(VSS) DD2.L3(VSS) DD2.L9(VSSQ) DD2.M1(VSSQ) DD2.N1(VSSQ) DD2.P3(VSSQ) DD2.P8(VSSQ) DD2.R3(VSS) R6.1 R7.1 R8.2 R9.2 R10.2 R11.2 R12.2 R13.2 R14.2 R15.2 R16.2 R17.2 R18.2 R19.2 R20.2 R21.2 R22.2 R23.2 ; port GND
SDN_RAS: DD2.J9(RAS#) ; port FMC_SDNRAS  [project net FMC_SDNRAS]
SDNCAS: DD2.K7(CAS#) ; port FMC_SDNCAS  [project net FMC_SDNCAS]
SDNCS: DD2.J8(CS#) ; port FMC_SDNCS  [project net FMC_SDNCS]
FMC_A0: DD2.G8(A0)
FMC_A1: DD2.G9(A1)
FMC_A2: DD2.F7(A2)
FMC_A3: DD2.F3(A3)
FMC_A4: DD2.G1(A4)
FMC_A5: DD2.G2(A5)
FMC_A6: DD2.G3(A6)
FMC_A7: DD2.H1(A7)
FMC_A8: DD2.H2(A8)
FMC_A9: DD2.J3(A9)
FMC_A10: DD2.G7(A10)
FMC_A11: DD2.H9(A11)
FMC_BA0: DD2.H8(BA1) ; port FMC_BA0
FMC_D0: DD2.R8(DQ0)
FMC_D1: DD2.N7(DQ1)
FMC_D2: DD2.R9(DQ2)
FMC_D3: DD2.N8(DQ3)
FMC_D4: DD2.P9(DQ4)
FMC_D5: DD2.M8(DQ5)
FMC_D6: DD2.M7(DQ6)
FMC_D7: DD2.L8(DQ7)
FMC_D8: DD2.L2(DQ8)
FMC_D9: DD2.M3(DQ9)
FMC_D10: DD2.M2(DQ10)
FMC_D11: DD2.P1(DQ11)
FMC_D12: DD2.N2(DQ12)
FMC_D13: DD2.R1(DQ13)
FMC_D14: DD2.N3(DQ14)
FMC_D15: DD2.R2(DQ15)
FMC_NBL0: DD2.K1(DQM1) ; port FMC_NBL0
SDN_CKE: DD2.J2(CKE) ; port FMC_SDNCKE  [project net FMC_SDNCKE]
SDN_CLK: DD2.J1(CLK) ; port FMC_SDNCLK  [project net FMC_SDNCLK]
SDNWE: DD2.K8(WE#) ; port FMC_SDNWE  [project net FMC_SDNWE]
NetDD2_A1: DD2.A1(DQ26) R18.1
NetDD2_A2: DD2.A2(DQ24) R19.1
NetDD2_A8: DD2.A8(DQ23) R12.1
NetDD2_A9: DD2.A9(DQ21) R13.1
NetDD2_B1: DD2.B1(DQ28) R17.1
NetDD2_B9: DD2.B9(DQ19) R14.1
NetDD2_C2: DD2.C2(DQ27) R10.1
NetDD2_C3: DD2.C3(DQ25) R11.1
NetDD2_C7: DD2.C7(DQ22) R20.1
NetDD2_C8: DD2.C8(DQ20) R21.1
NetDD2_D2: DD2.D2(DQ29) R9.1
NetDD2_D3: DD2.D3(DQ30) R16.1
NetDD2_D7: DD2.D7(DQ17) R15.1
NetDD2_D8: DD2.D8(DQ18) R22.1
NetDD2_E2: DD2.E2(DQ31) R8.1
NetDD2_E8: DD2.E8(DQ16) R23.1
NetDD2_F2: DD2.F2(DQM3) R6.2
NetDD2_F8: DD2.F8(DQM2) R7.2

Not connected (* = marked no-connect by the designer): DD2 E3(NC) E7(NC) H3(NC) H7(NC) K2(NU) K3(NC)

### Buses and harness runs
bus FMC_A[0..11] = port FMC_A[0..11]
bus FMC_D[0..15] = port FMC_D[0..15]

### Layout directives
net class SDRAM: (no net found under the mark), FMC_BA0, FMC_BA1, FMC_NBL0, FMC_NBL1, FMC_SDNCAS, FMC_SDNCKE, FMC_SDNCLK, FMC_SDNCS, FMC_SDNRAS, FMC_SDNWE
net class DIGIT: NetDD2_A1, NetDD2_A2, NetDD2_A8, NetDD2_A9, NetDD2_B1, NetDD2_B9, NetDD2_C2, NetDD2_C3, NetDD2_C7, NetDD2_C8, NetDD2_D2, NetDD2_D3, NetDD2_D7, NetDD2_D8, NetDD2_E2, NetDD2_E8, NetDD2_F2, NetDD2_F8

### Notes on the sheet
- Перв. примен.
- Справ. №
- Подп. и дата
- Инв. № дубл.
- Взам. инв. №
- Разраб.
- Изм.
- Лист
- № докум.
- Подп.
- Дата
- Лит.
- Масса
- Масштаб
- Пров.
- Т.контр.
- Листов
- Инв. № подл.
- Утв.
- Н.контр.
- Копировал
- Формат А3

### Library data of the parts
C24-C37 = Capasitor: Value: *; Voltage: *; Part Number: *; Quantity: *; Package: *; Price: *; Manufacturer: *; ShoppingPlace: *
DD2 = mt48lc4m32b2b5-6a: Manufacturer: MICRON; Part Number: MT48LC4M32B2B5-6A; Price: 10; Package: VBGA90; Quantity: 1; Documantation: https://www.micron.com/parts/dram/sdram/mt48lc4m32b2b5-6a-it
R6-R23 = Resistor: Manufacturer: *; Quntity: *; Price: *; Part Number: *; Package: *; Value: *; Power: *

## Nets that join several sheets
1V8: MPU (30 pins), ST-LINK (C52.1 DA3.2)
3V3: MPU (R4.2), ST-LINK (19 pins), SDRAMPart (28 pins)
FMC_BA1: MPU (DD1.B5), SDRAMPart (DD2.J7)
FMC_NBL1: MPU (DD1.C7), SDRAMPart (DD2.K9)
FMC_SDNCAS: MPU (DD1.B7), SDRAMPart (DD2.K7)
FMC_SDNRAS: MPU (DD1.C8), SDRAMPart (DD2.J9)
GND: MPU (29 pins), ST-LINK (43 pins), SDRAMPart (46 pins)
NRST: MPU (DD1.E1 R4.1), ST-LINK (DD3.18)
SWCLK: MPU (DD1.A9), ST-LINK (DD3.15 DD3.26)
SWDIO: MPU (DD1.A10), ST-LINK (DD3.25 R31.1)
SWO: MPU (DD1.A7), ST-LINK (DD3.31)
VCP_RX: MPU (DD1.A5), ST-LINK (DD3.13)
VCP_TX: MPU (DD1.C9), ST-LINK (DD3.12)
FMC_A0: MPU (DD1.F1), SDRAMPart (DD2.G8)
FMC_A1: MPU (DD1.F2), SDRAMPart (DD2.G9)
FMC_A2: MPU (DD1.F3), SDRAMPart (DD2.F7)
FMC_A3: MPU (DD1.F9), SDRAMPart (DD2.F3)
FMC_A4: MPU (DD1.F10), SDRAMPart (DD2.G1)
FMC_A5: MPU (DD1.G2), SDRAMPart (DD2.G2)
FMC_A6: MPU (DD1.G3), SDRAMPart (DD2.G3)
FMC_A7: MPU (DD1.G4), SDRAMPart (DD2.H1)
FMC_A8: MPU (DD1.G5), SDRAMPart (DD2.H2)
FMC_A9: MPU (DD1.G9), SDRAMPart (DD2.J3)
FMC_A10: MPU (DD1.G10), SDRAMPart (DD2.G7)
FMC_A11: MPU (DD1.H2), SDRAMPart (DD2.H9)
FMC_BA0: MPU (DD1.B4), SDRAMPart (DD2.H8)
FMC_D0: MPU (DD1.H8), SDRAMPart (DD2.R8)
FMC_D1: MPU (DD1.G8), SDRAMPart (DD2.N7)
FMC_D2: MPU (DD1.D8), SDRAMPart (DD2.R9)
FMC_D3: MPU (DD1.E8), SDRAMPart (DD2.N8)
FMC_D4: MPU (DD1.H5), SDRAMPart (DD2.P9)
FMC_D5: MPU (DD1.J5), SDRAMPart (DD2.M8)
FMC_D6: MPU (DD1.K5), SDRAMPart (DD2.M7)
FMC_D7: MPU (DD1.G6), SDRAMPart (DD2.L8)
FMC_D8: MPU (DD1.H6), SDRAMPart (DD2.L2)
FMC_D9: MPU (DD1.J6), SDRAMPart (DD2.M3)
FMC_D10: MPU (DD1.K6), SDRAMPart (DD2.M2)
FMC_D11: MPU (DD1.G7), SDRAMPart (DD2.P1)
FMC_D12: MPU (DD1.H7), SDRAMPart (DD2.N2)
FMC_D13: MPU (DD1.D6), SDRAMPart (DD2.R1)
FMC_D14: MPU (DD1.K9), SDRAMPart (DD2.N3)
FMC_D15: MPU (DD1.J9), SDRAMPart (DD2.R2)
FMC_NBL0: MPU (DD1.C6), SDRAMPart (DD2.K1)
FMC_SDNCKE: MPU (DD1.B8), SDRAMPart (DD2.J2)
FMC_SDNCLK: MPU (DD1.B6), SDRAMPart (DD2.J1)
FMC_SDNWE: MPU (DD1.B9), SDRAMPart (DD2.K8)